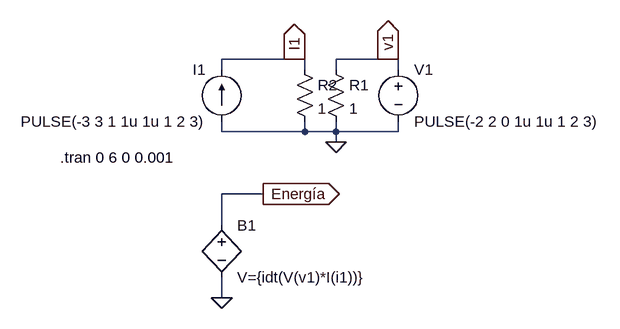
[diagram p0: schematic g1_p2.asc]
g1_p2.asc, the LTspice schematic file:
Version 4
SHEET 1 880 680
WIRE 128 96 16 96
WIRE 144 96 128 96
WIRE 272 96 192 96
WIRE 288 96 272 96
WIRE 16 112 16 96
WIRE 144 112 144 96
WIRE 192 112 192 96
WIRE 288 112 288 96
WIRE 16 208 16 192
WIRE 144 208 144 192
WIRE 144 208 16 208
WIRE 192 208 192 192
WIRE 192 208 144 208
WIRE 288 208 288 192
WIRE 288 208 192 208
WIRE 192 224 192 208
WIRE 80 304 16 304
WIRE 16 352 16 304
WIRE 16 464 16 432
FLAG 192 224 0
FLAG 272 96 v1
IOPIN 272 96 Out
FLAG 128 96 I1
IOPIN 128 96 Out
FLAG 16 464 0
FLAG 80 304 Energía
IOPIN 80 304 Out
SYMBOL current 16 192 R180
WINDOW 0 24 80 Left 2
WINDOW 3 24 0 Left 2
WINDOW 123 0 0 Left 0
WINDOW 39 0 0 Left 0
SYMATTR InstName I1
SYMATTR Value PULSE(-3 3 1 1u 1u 1 2 3)
SYMBOL voltage 288 96 R0
WINDOW 123 0 0 Left 0
WINDOW 39 0 0 Left 0
SYMATTR InstName V1
SYMATTR Value PULSE(-2 2 0 1u 1u 1 2 3)
SYMBOL res 176 96 R0
SYMATTR InstName R1
SYMATTR Value 1
SYMBOL res 128 96 R0
SYMATTR InstName R2
SYMATTR Value 1
SYMBOL bv 16 336 R0
SYMATTR InstName B1
SYMATTR Value V={idt(V(v1)*I(i1))}
TEXT -232 248 Left 2 !.tran 0 6 0 0.001

The netlist it stands for:
* g1_p2.asc
I1 0 I1 PULSE(-3 3 1 1u 1u 1 2 3)
V1 v1 0 PULSE(-2 2 0 1u 1u 1 2 3)
R1 v1 0 1
R2 I1 0 1
B1 Energía 0 V={idt(V(v1)*I(i1))}
.tran 0 6 0 0.001
.backanno
.end